# Altium schematic sheet ISO_I2C.SchDoc
size A4; SheetNumber: 6; SheetTotal: 8
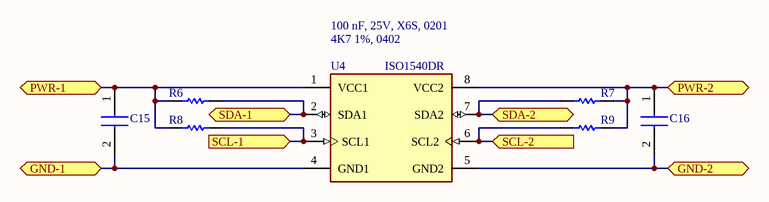
[diagram p0: ISO_I2C.SchDoc]

## Parts
C15  100 nF, 25V, X6S, 0201  [CAPC0603X33N]  (value not drawn)
C16  100 nF, 25V, X6S, 0201  [CAPC0603X33N]  (value not drawn)
R6  4K7 1%, 0402  [RESC1005X40X25LL05T05]  (value not drawn)
R7  4K7 1%, 0402  [RESC1005X40X25LL05T05]  (value not drawn)
R8  4K7 1%, 0402  [RESC1005X40X25LL05T05]  (value not drawn)
R9  4K7 1%, 0402  [RESC1005X40X25LL05T05]  (value not drawn)
U4  ISO1540DR  [FP-D0008A-MFG]

## Ports
GND-1 (bidir, see CellVoltageControl[3B]), GND-2 (bidir, see CellVoltageControl[4B]), PWR-1 (bidir, see CellVoltageControl[3B]), PWR-2 (bidir, see CellVoltageControl[4B]), SCL-1 (in, see CellVoltageControl[3B]), SCL-2 (in, see CellVoltageControl[4B]), SDA-1 (bidir, see CellVoltageControl[3B]), SDA-2 (bidir, see CellVoltageControl[4B])

## Nets
GND-1: C15.2 U4.4(GND1) ; port GND-1
GND-2: C16.2 U4.5(GND2) ; port GND-2
PWR-1: C15.1 R6.2 R8.2 U4.1(VCC1) ; port PWR-1
PWR-2: C16.1 R7.1 R9.1 U4.8(VCC2) ; port PWR-2
SCL-1: R8.1 U4.3(SCL1) ; port SCL-1
SCL-2: R9.2 U4.6(SCL2) ; port SCL-2
SDA-1: R6.1 U4.2(SDA1) ; port SDA-1
SDA-2: R7.2 U4.7(SDA2) ; port SDA-2

## Notes on the sheet
- 100 nF, 25V, X6S, 0201
- (near U4) 4K7 1%, 0402

## Library data of the parts
C15 C16 = GRM033C81E104KE14D: Capacitor; Manufacturer_Name: Murata Electronics; Datasheet Link: https://search.murata.co.jp/Ceramy/image/img/A01X/G101/ENG/GRM033C81E104KE14-01A.pdf; Height: 0.33mm; Manufacturer_Part_Number: GRM033C81E104KE14D; Mouser Part Number: 81-GRM33C81E104KE14D; Mouser Price/Stock: https://www.mouser.co.uk/ProductDetail/Murata-Electronics/GRM033C81E104KE14D?qs=P%2FC4Eoq9CDwxe7d5nXqGrA%3D%3D; Arrow Part Number: GRM033C81E104KE14D; Arrow Price/Stock: https://www.arrow.com/en/products/grm033c81e104ke14d/murata-manufacturing
R6-R9 = CMP-2002-01154-4: Chip Resistor, 4.7 KOhm, +/- 1%, 0.1 W, -55 to 155 degC, 0402 (1005 Metric), RoHS, Tape and Reel; PartNumber: ERJ-2RKF4701X; Voltage Rating: 50 V; Case\/Package: 0402; Power Rating: 100 mW; Height: 0.35 mm; Mounting Technology: Surface Mount; REACH SVHC: Yes; Resistance: 4.7 KOhm; Max Operating Temperature: 155 degC; ComponentLink1Description: Manufacturer URL; ComponentLink2Description: Datasheet; Pins: 2; PackageReference: 0402; Tolerance: 1%; Case Code (Imperial): 0402; Length: 1 mm; PackageDescription: 2-Pin Surface Mount Device, Body 1 x 0.5 mm; RoHSCompliant: true; Package Quantity: 1; Radiation Hardening: No; DatasheetVersion: 04/2015; Width: 0.5 mm; Case Code (Metric): 1005; Mount: Surface Mount; ComponentLink1URL: http://www.panasonic.com/; Min Operating Temperature: -55 degC; Packaging: Cut Tape; ComponentLink2URL: http://industrial.panasonic.com/cdbs/www-data/pdf/RDA0000/AOA0000C86.pdf
U4 = CMP-04872-000011-1: DGTL ISO 2.5KV 2CH I2C 8SOIC; Manufacturer: Texas Instruments; Max Supply Voltage: 5.5V; Interface: I2C,SMBus,Other; Nominal Supply Current: 1.7-3.1mA; Standoff Height: 0.11mm; Max Junction Temp: +136°C; Min Supply Voltage: 3V; Ipc Land Pattern Name: SOIC127P600X175-8; Ambient Temperature Range Low: -40°C; Temperature: -40°C to +125°C; Device Class L3: unset; Mouser Description: Digital Isolators Low-Power,Bidirec I2C Iso; Manufacturer Part Number: ISO1540DR; Octopart: https://octopart.com/iso1540dr-texas+instruments-24334113; Digikey Description: DGTL ISO 2.5KV 2CH I2C 8SOIC; Category: IC; Height: 1.75mm; Ambient Temperature Range High: +125°C; RoHS: TRUE; Automotive: No; Package: D0008A; ComponentLink2URL: http://www.ti.com/lit/ds/symlink/iso1540.pdf; Device Class L2: Interface ICs; Device Class L1: Integrated Circuits (ICs); Temperature Range Low: -40°C; Lead Free: Yes; ComponentLink2Description: Datasheet; Temperature Range High: +125°C